# EAGLE schematic ECE445-Transmitter-Schematic (EAGLE 7.5.0)
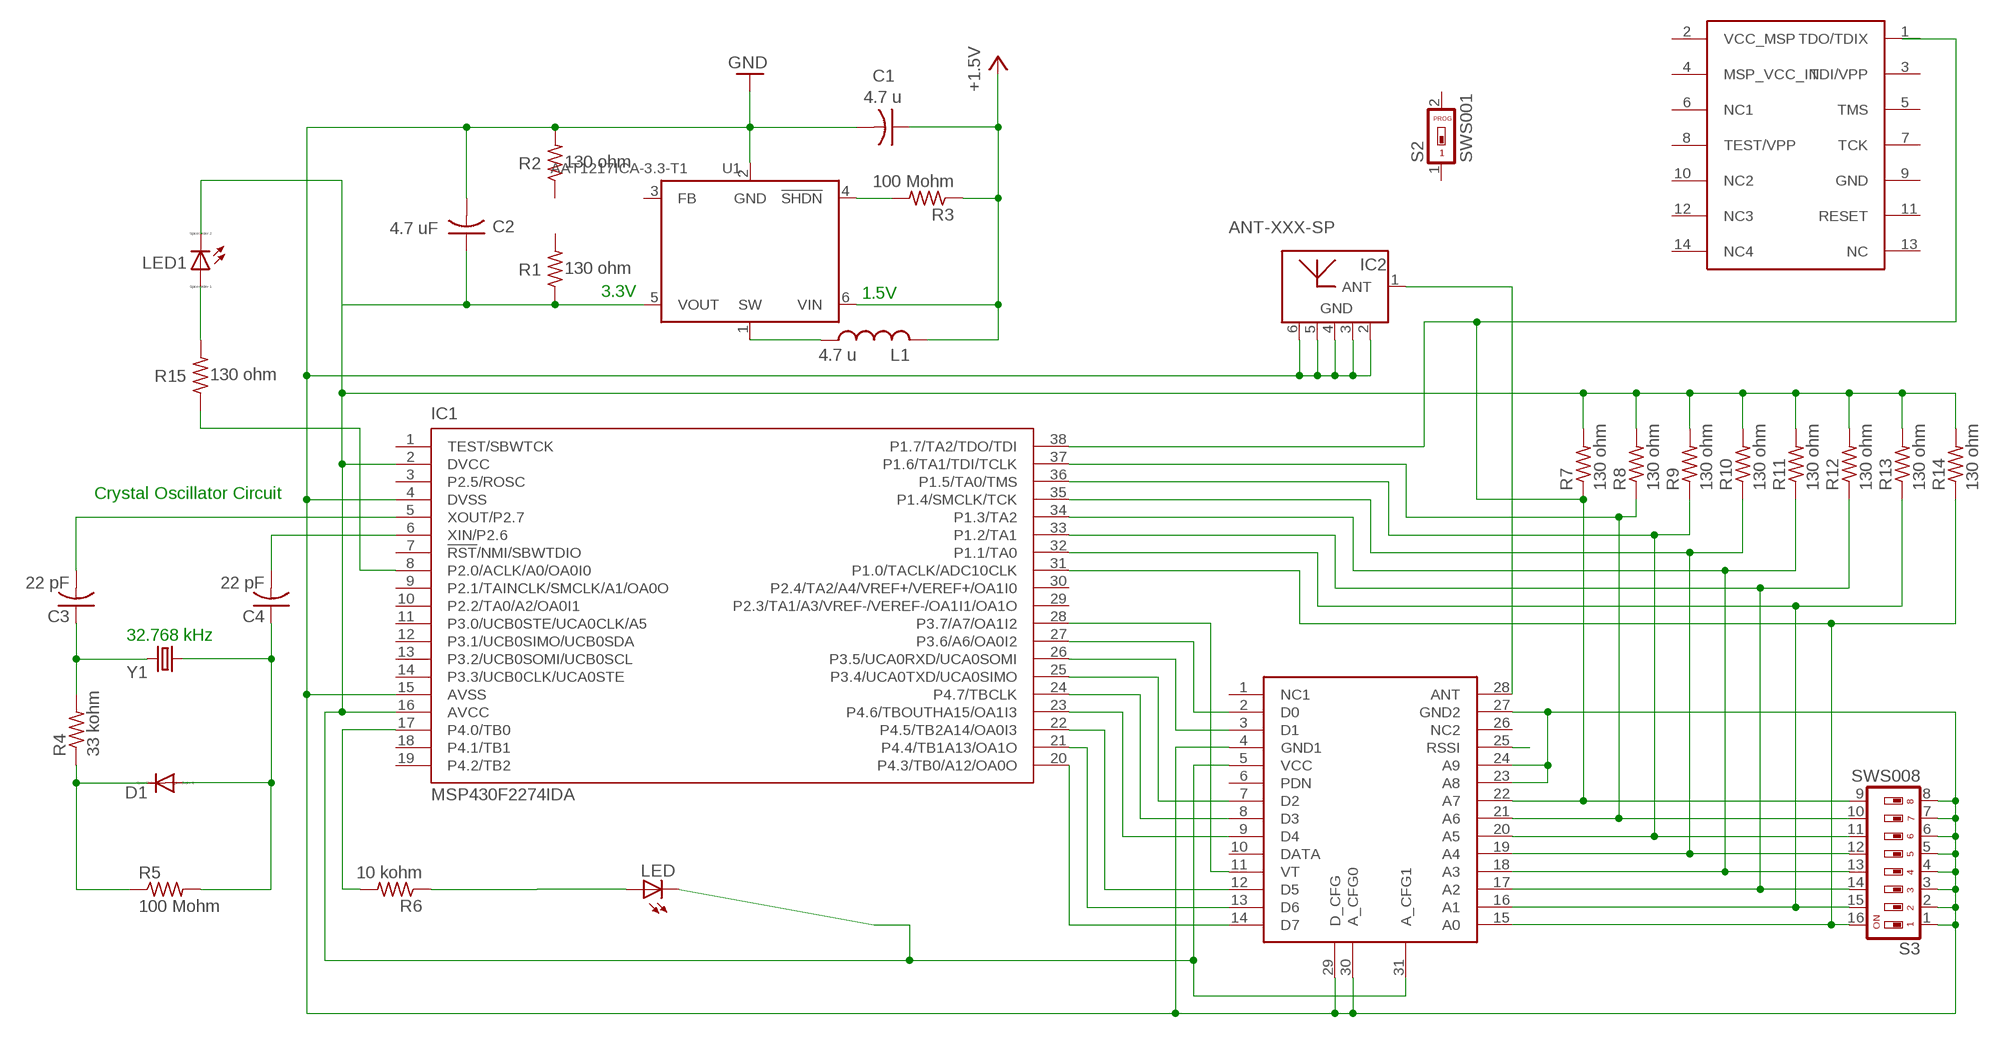
[diagram p0: schematic, sheet 1]

## Parts
C1  4.7 u  C-US025-024X044  [C025-024X044]
C2  4.7 uF  C-US025-024X044  [C025-024X044]
C3  22 pF  C-US025-024X044  [C025-024X044]
C4  22 pF  C-US025-024X044  [C025-024X044]
D1  1N4004  [DO41-10]
IC1  MSP430F2274IDA  [TSSOP38_R-PDSO-G38-DA]
IC2  ANT-XXX-SP  [ANT-XXX-SP]
L1  4.7 u  L-US0204/5  [0204/5]
LED  LAP4-BOTTOM  [P47F-BOTTOM]
LED1  LED_ELD260  [LED_LD260]
R1  130 ohm  R-US_0204/5  [0204/5]
R2  130 ohm  R-US_0204/5  [0204/5]
R3  100 Mohm  R-US_0204/2V  [0204V]
R4  33 kohm  R-US_0204/2V  [0204V]
R5  100 Mohm  R-US_0204/2V  [0204V]
R6  10 kohm  R-US_0204/2V  [0204V]
R7  130 ohm  R-US_0204/5  [0204/5]
R8  130 ohm  R-US_0204/5  [0204/5]
R9  130 ohm  R-US_0204/5  [0204/5]
R10  130 ohm  R-US_0204/5  [0204/5]
R11  130 ohm  R-US_0204/5  [0204/5]
R12  130 ohm  R-US_0204/5  [0204/5]
R13  130 ohm  R-US_0204/5  [0204/5]
R14  130 ohm  R-US_0204/5  [0204/5]
R15  130 ohm  R-US_0204/5  [0204/5]
S2  SWS001  [SMS-001]
S3  SWS008  [SMS-008]
U1  AAT1217ICA-3.3-T1  [TSOT-23-6]
U$1  KH3-RXM-LINX-315  [KH3-RXM-LINX-315]
X1  87758-1416  [87758-1416]
Y1  CRYSTAL32-SMD-MELF  [CRYSTAL-32KHZ-SMD-MELF]

## Nets
+3V3: C1.1 L1.2 R3.1 U1.6(VIN) ; supply symbol labelled +1.5V
GND: C1.2 C2.2 IC1.4(DVSS) IC1.15(AVSS) IC2.2(GND) IC2.3(GND) IC2.4(GND) IC2.5(GND) IC2.6(GND) R2.2 S3.1 S3.2 S3.3 S3.4 S3.5 S3.6 S3.7 S3.8 U1.2(GND) U$1.4(GND1) U$1.23(A8) U$1.24(A9) U$1.27(GND2) U$1.29(D_CFG) U$1.30(A_CFG0)
N$1: LED.C
N$2: LED.A
N$3: IC1.17(P4.0/TB0) R6.2
N$4: C4.2 IC1.6(XIN/P2.6)
N$5: C3.2 IC1.5(XOUT/P2.7)
N$6: C3.1 R4.2 Y1.X2
N$7: R6.1
N$8: D1.C R4.1 R5.1
N$9: IC2.1(ANT) U$1.28(ANT)
N$10: L1.1 U1.1(SW)
N$11: C2.1 IC1.2(DVCC) IC1.16(AVCC) LED1.K(C) R1.1 R7.2 R8.2 R9.2 R10.2 R11.2 R12.2 R13.2 R14.2 U1.5(VOUT) U$1.5(VCC) U$1.31(A_CFG1)
N$12: C4.1 D1.A R5.2 Y1.X1
N$13: U$1.25(RSSI)
N$14: IC1.27(P3.6/A6/OA0I2) U$1.2(D0)
N$15: IC1.35(P1.4/SMCLK/TCK) R10.1 S3.12 U$1.19(A4)
N$16: IC1.37(P1.6/TA1/TDI/TCLK) R8.1 S3.10 U$1.21(A6)
N$17: IC1.8(P2.0/ACLK/A0/OA0I0) R15.1
N$18: IC1.28(P3.7/A7/OA1I2) U$1.11(VT)
N$19: R3.2 U1.4(!SHDN)
N$20: IC1.33(P1.2/TA1) R12.1 S3.14 U$1.17(A2)
N$21: IC1.32(P1.1/TA0) R13.1 S3.15 U$1.16(A1)
N$22: IC1.20(P4.3/TB0/A12/OA0O) U$1.14(D7)
N$23: IC1.21(P4.4/TB1A13/OA1O) U$1.13(D6)
N$24: IC1.22(P4.5/TB2A14/OA0I3) U$1.12(D5)
N$25: IC1.23(P4.6/TBOUTHA15/OA1I3) U$1.9(D4)
N$26: IC1.24(P4.7/TBCLK) U$1.8(D3)
N$27: IC1.25(P3.4/UCA0TXD/UCA0SIMO) U$1.7(D2)
N$28: IC1.26(P3.5/UCA0RXD/UCA0SOMI) U$1.3(D1)
N$29: IC1.36(P1.5/TA0/TMS) R9.1 S3.11 U$1.20(A5)
N$30: IC1.38(P1.7/TA2/TDO/TDI) R7.1 S3.9 U$1.22(A7)
N$31: LED1.A R15.2
N$37: IC1.34(P1.3/TA2) R11.1 S3.13 U$1.18(A3)
N$40: IC1.31(P1.0/TACLK/ADC10CLK) R14.1 S3.16 U$1.15(A0)
Unconnected: IC1.1(TEST/SBWTCK) IC1.3(P2.5/ROSC) IC1.7(!RST!/NMI/SBWTDIO) IC1.9(P2.1/TAINCLK/SMCLK/A1/OA0O) IC1.10(P2.2/TA0/A2/OA0I1) IC1.11(P3.0/UCB0STE/UCA0CLK/A5) IC1.12(P3.1/UCB0SIMO/UCB0SDA) IC1.13(P3.2/UCB0SOMI/UCB0SCL) IC1.14(P3.3/UCB0CLK/UCA0STE) IC1.18(P4.1/TB1) IC1.19(P4.2/TB2) IC1.29(P2.3/TA1/A3/VREF-/VEREF-/OA1I1/OA1O) IC1.30(P2.4/TA2/A4/VREF+/VEREF+/OA1I0) R1.2 R2.1 S2.1 S2.2 U1.3(FB) U$1.1(NC1) U$1.6(PDN) U$1.10(DATA) U$1.26(NC2) X1.1(TDO/TDIX) X1.2(VCC_MSP) X1.3(TDI/VPP) X1.4(MSP_VCC_IN) X1.5(TMS) X1.6(NC1) X1.7(TCK) X1.8(TEST/VPP) X1.9(GND) X1.10(NC2) X1.11(RESET) X1.12(NC3) X1.13(NC) X1.14(NC4)

## Notes on the sheet
- 3.3V | 1.5V
- Crystal Oscillator Circuit
- 32.768 kHz

## Library data of the parts
C1-C4 = rcl:C-US: CAPACITOR, American symbol
D1 = diode:1N4004: DIODE general purpose rectifier, 1 A
IC1 = texas:MSP430F22*4IDA: MIXED SIGNAL MICROCONTROLLER Source: http://focus.ti.com/lit/ds/symlink/msp430f2274.pdf; MPN: MSP430F2274IDA; OC_FARNELL: 1610179; OC_NEWARK: 28M6350
IC2 = linx:ANT-XXX-SP: ANT-315-SP Source: http://www.antennafactor.com/documents/ANT-315-SP_Data_Sheet.pdf; OC_FARNELL: unknown; OC_NEWARK: unknown
L1 = rcl:L-US: INDUCTOR, American symbol
LED = led:*P4: PointLED® Enhanced Thinfilm LED TOP & BOTTOM mount LS P47F, LR P47F, LA P47F, LY P47F, LT P4SG, LB P4SG, LW P4SG Source: http://catalog.osram-os.com .. LA_LR_LS_LY_P47F_Pb_free.pdf
LED1 = eagle-ltspice:LED_E: LED Source: http://www.osram.convergy.de Source: www.luxeon.com Source: www.kingbright.com; SPICEMODEL: NONE; SPICEPREFIX: D; SPICETYPE: diode
R1-R15 = rcl:R-US_: RESISTOR, American symbol
S2 = smd-special:SWS001: SMD Dip Switch 1 pol.
S3 = smd-special:SWS008: SMD Dip Switch 8 pol.
U1 = Skyworks:AAT1217
U$1 = KH3-RXM-LINX-315:KH3-RXM-LINX-315
X1 = 14-pin-ribbon:87758-1416: 14 Pin - 2mm Dual Row Single Wafer, Vertical T/H HDR Source: http://www.molex.com/pdm_docs/sd/877580616_sd.pdf; MF: MOLEX; MPN: 87758-1416; OC_FARNELL: 7472358; OC_NEWARK: 59J1562
Y1 = SparkFun-FreqCtrl:CRYSTAL: Various standard crystals. Proven footprints.; PROD_ID: XTAL-07894